# EAGLE design untitled (EAGLE 5.10)
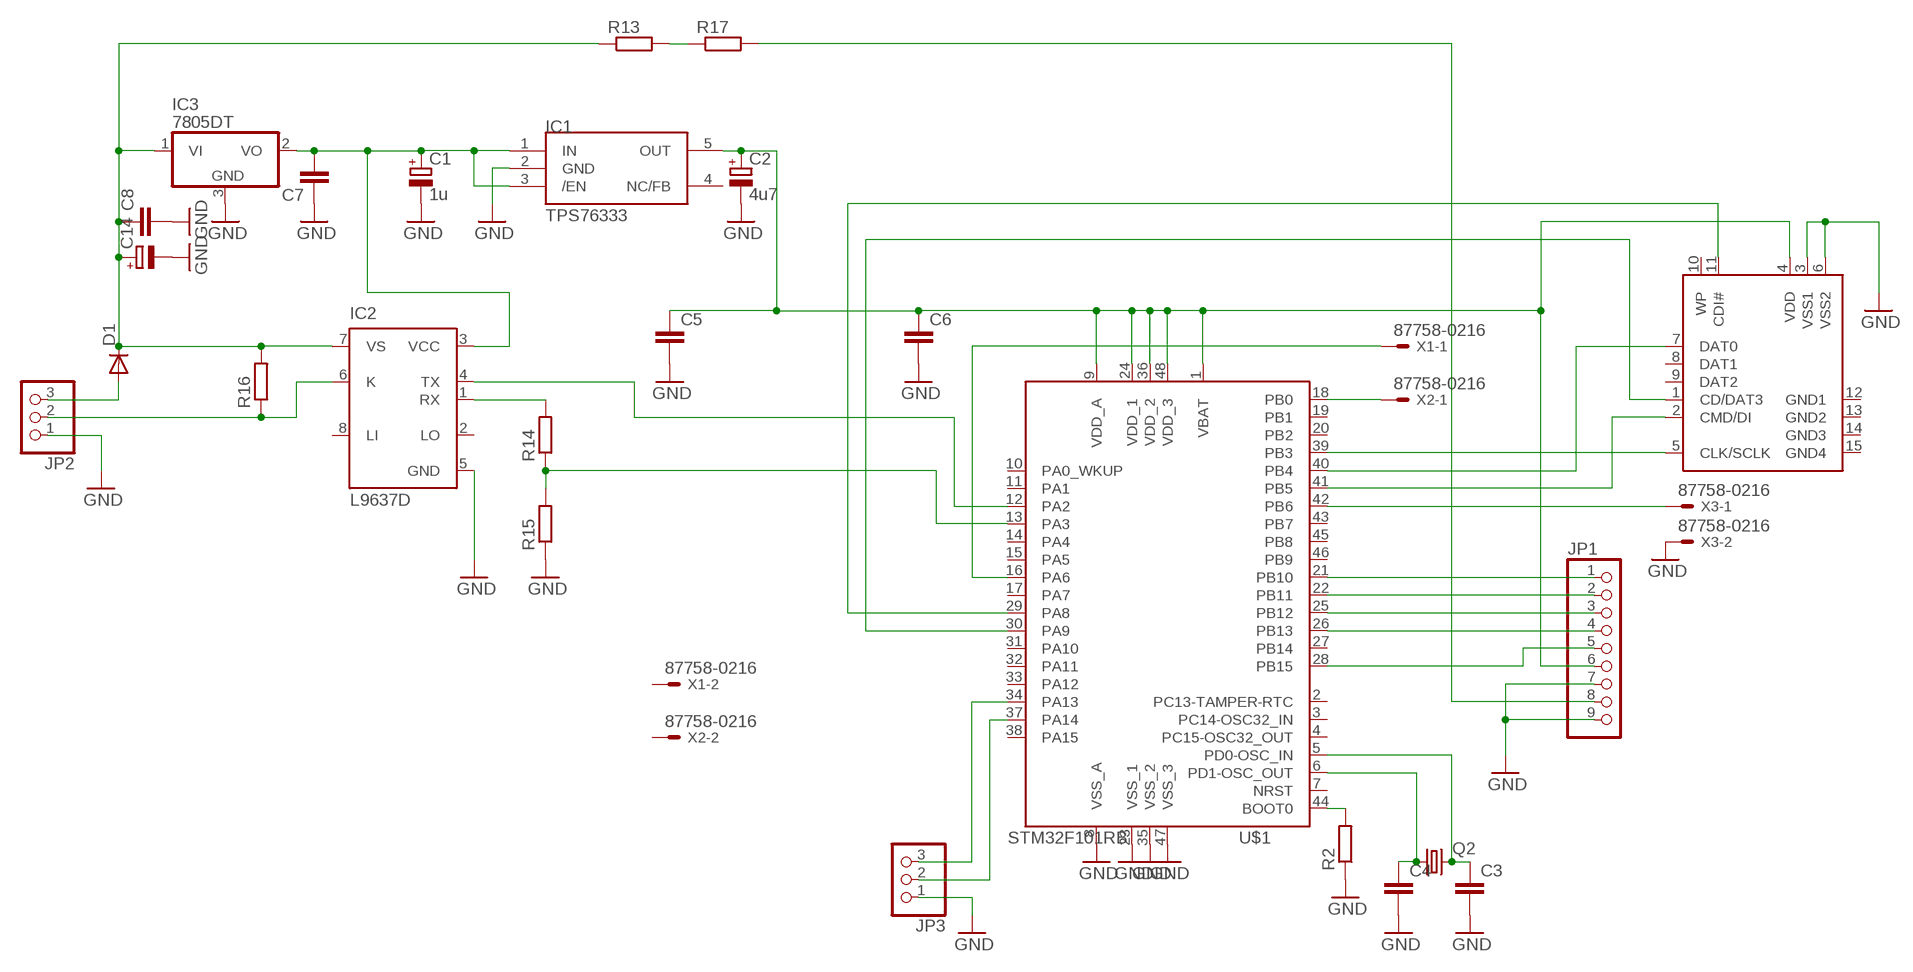
[diagram p0: schematic, sheet 1]

## Parts
C1  1u  CPOL-EUSMCA  [SMC_A]
C2  4u7  CPOL-EUSMCA  [SMC_A]
C3  C-EUC0603  [C0603]
C4  C-EUC0603  [C0603]
C5  C-EUC0603  [C0603]
C6  C-EUC0603  [C0603]
C7  C-EUC0805  [C0805]
C8  C-EUC1206  [C1206]
C14  CPOL-EU153CLV-0605  [153CLV-0605]
D1  DIODE-MINIMELF  [MINIMELF]
IC1  TPS76333  TPS769XX  [SOT23-5L]
IC2  L9637D  [SO08]
IC3  7805DT  [TO252]
JP1  PINHD-1X9  [1X09]
JP2  PINHD-1X3  [1X03]
JP3  PINHD-1X3  [1X03]
Q2  CRYSTALHC49S  [HC49/S]
R2  R-EU_R0603  [R0603]
R13  R-EU_R1206  [R1206]
R14  R-EU_R0603  [R0603]
R15  R-EU_R0603  [R0603]
R16  R-EU_R1206  [R1206]
R17  R-EU_R1206  [R1206]
U$1  STM32F101RB  [LQFP48]
U$2  SDCARDVAR1  [SDCMF-10915W010]
X1  87758-0216  [87758-0216]
X2  87758-0216  [87758-0216]
X3  87758-0216  [87758-0216]

## Nets
GND: C1.- C2.- C3.2 C4.2 C5.2 C6.2 C7.1 C8.2 C14.- IC1.2(GND) IC2.5(GND) IC3.3(GND) JP1.7 JP1.9 JP2.1 JP3.1 R2.1 R15.1 U$1.8(VSS_A) U$1.23(VSS_1) U$1.35(VSS_2) U$1.47(VSS_3) U$2.3(VSS1) U$2.6(VSS2) X3.2
N$1: JP1.5 U$1.28(PB15)
N$2: JP1.1 U$1.21(PB10)
N$3: C3.1 Q2.2 U$1.5(PD0-OSC_IN)
N$4: C4.1 Q2.1 U$1.6(PD1-OSC_OUT)
N$5: R2.2 U$1.44(BOOT0)
N$6: U$1.30(PA9) U$2.1(CD/DAT3)
N$7: JP1.4 U$1.26(PB13)
N$8: JP1.3 U$1.25(PB12)
N$9: JP1.2 U$1.22(PB11)
N$10: IC2.4(TX) U$1.12(PA2)
N$11: U$1.42(PB6) X3.1
N$12: C1.+ C7.2 IC1.1(IN) IC1.3(/EN) IC2.3(VCC) IC3.2(VO)
N$13: R14.1 R15.2 U$1.13(PA3)
N$14: IC2.1(RX) R14.2
N$15: C8.1 C14.+ D1.C IC2.7(VS) IC3.1(VI) R13.1 R16.2
N$16: IC2.6(K) JP2.2 R16.1
N$19: U$1.29(PA8) U$2.11(CDI#)
N$20: JP1.8 R17.2
N$21: U$1.39(PB3) U$2.5(CLK/SCLK)
N$22: D1.A JP2.3
N$23: JP3.2 U$1.37(PA14)
N$24: U$1.41(PB5) U$2.2(CMD/DI)
N$25: U$1.40(PB4) U$2.7(DAT0)
N$26: JP3.3 U$1.34(PA13)
N$33: U$1.16(PA6) X1.1
N$35: C2.+ C5.1 C6.1 IC1.5(OUT) JP1.6 U$1.1(VBAT) U$1.9(VDD_A) U$1.24(VDD_1) U$1.36(VDD_2) U$1.48(VDD_3) U$2.4(VDD)
N$36: U$1.18(PB0) X2.1
N$41: R13.2 R17.1
Unconnected: IC1.4(NC/FB) IC2.2(LO) IC2.8(LI) U$1.2(PC13-TAMPER-RTC) U$1.3(PC14-OSC32_IN) U$1.4(PC15-OSC32_OUT) U$1.7(NRST) U$1.10(PA0_WKUP) U$1.11(PA1) U$1.14(PA4) U$1.15(PA5) U$1.17(PA7) U$1.19(PB1) U$1.20(PB2) U$1.27(PB14) U$1.31(PA10) U$1.32(PA11) U$1.33(PA12) U$1.38(PA15) U$1.43(PB7) U$1.45(PB8) U$1.46(PB9) U$2.8(DAT1) U$2.9(DAT2) U$2.10(WP) X1.2 X2.2

## Power pins joined to a net without a drawn wire
GND1: U$2.12(GND1)
GND2: U$2.13(GND2)
GND3: U$2.14(GND3)
GND4: U$2.15(GND4)

## Library data of the parts
C1 C2 C14 = rcl:CPOL-EU: POLARIZED CAPACITOR, European symbol
C3-C8 = rcl:C-EU: CAPACITOR, European symbol
D1 = diode:DIODE-: DIODE
IC1 = tps769xx:TPS769XX
IC2 = st-microelectronics:L9637D: ISO 9141 INTERFACE Source: 1765.pdf
IC3 = linear:78*: Positive VOLTAGE REGULATOR Source: http://cache.national.com/ds/LM/LM78L05.pdf http://www.fairchildsemi.com/ds/LM/LM7805.pdf
JP1 = pinhead:PINHD-1X9: PIN HEADER
JP2 JP3 = pinhead:PINHD-1X3: PIN HEADER
Q2 = crystal:CRYSTAL: CRYSTAL
R2 R13-R17 = rcl:R-EU_: RESISTOR, European symbol
U$1 = stm32:STM32F101RB
U$2 = kingfont_sdcmf10915w010:SDCARD: SD card connector KINGFONT SDCMF-10915W010
X1-X3 = con-molex:87758-0216: 2 Pin - 2mm Dual Row Single Wafer, Vertical T/H HDR Source: http://www.molex.com/pdm_docs/sd/877580616_sd.pdf

## Board
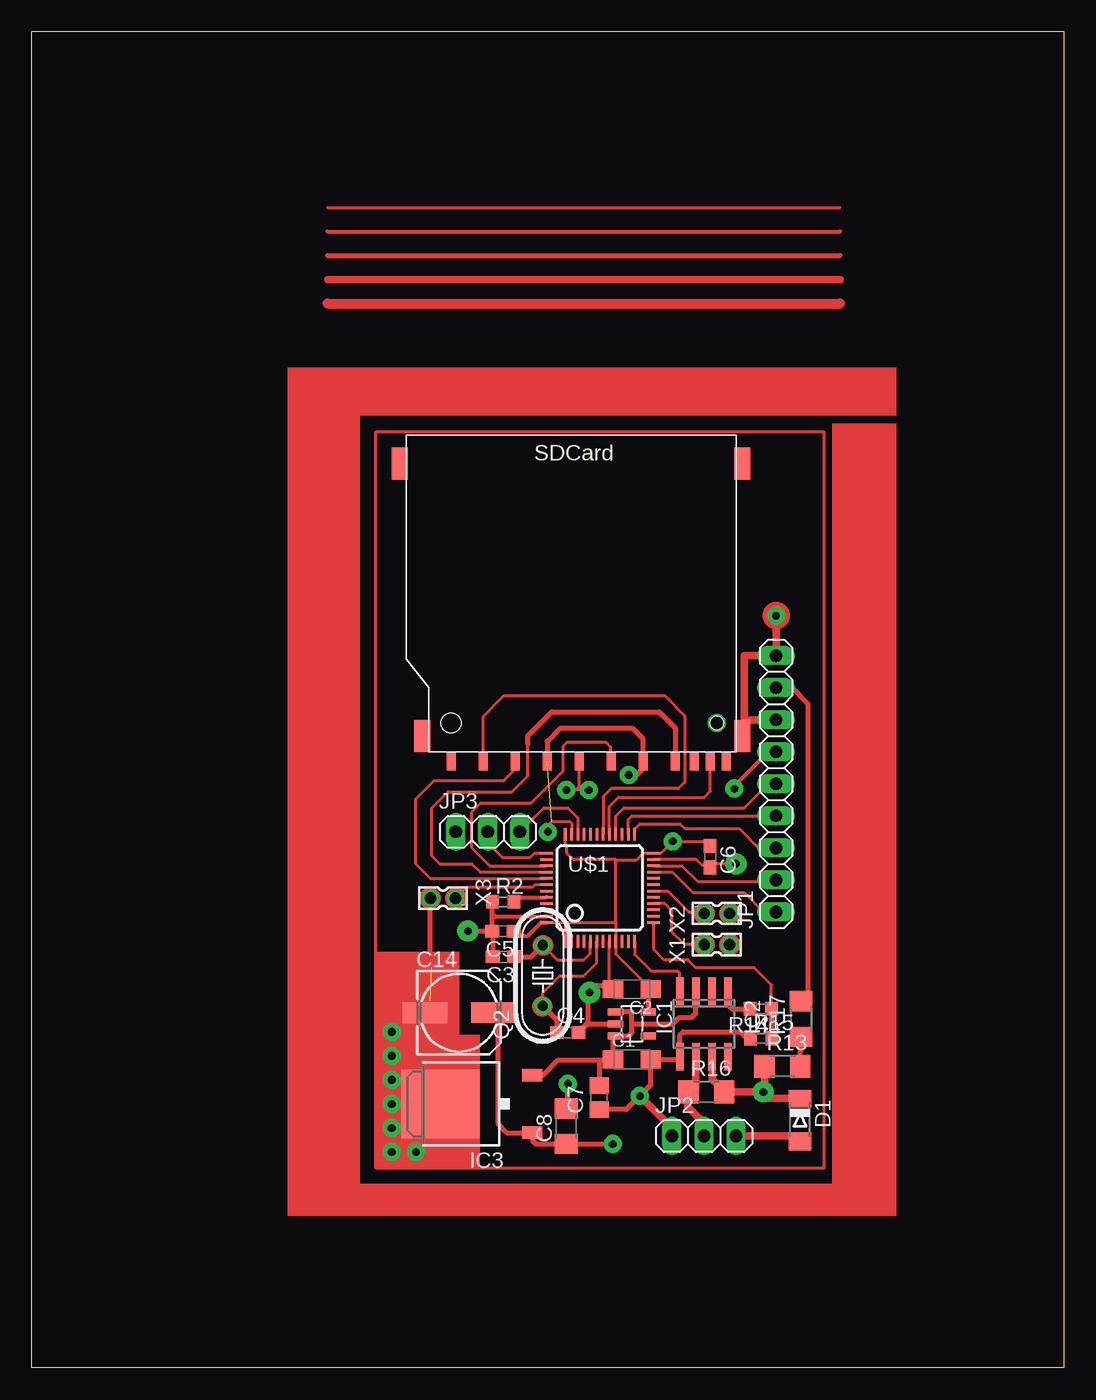
[diagram p1: board, top side]
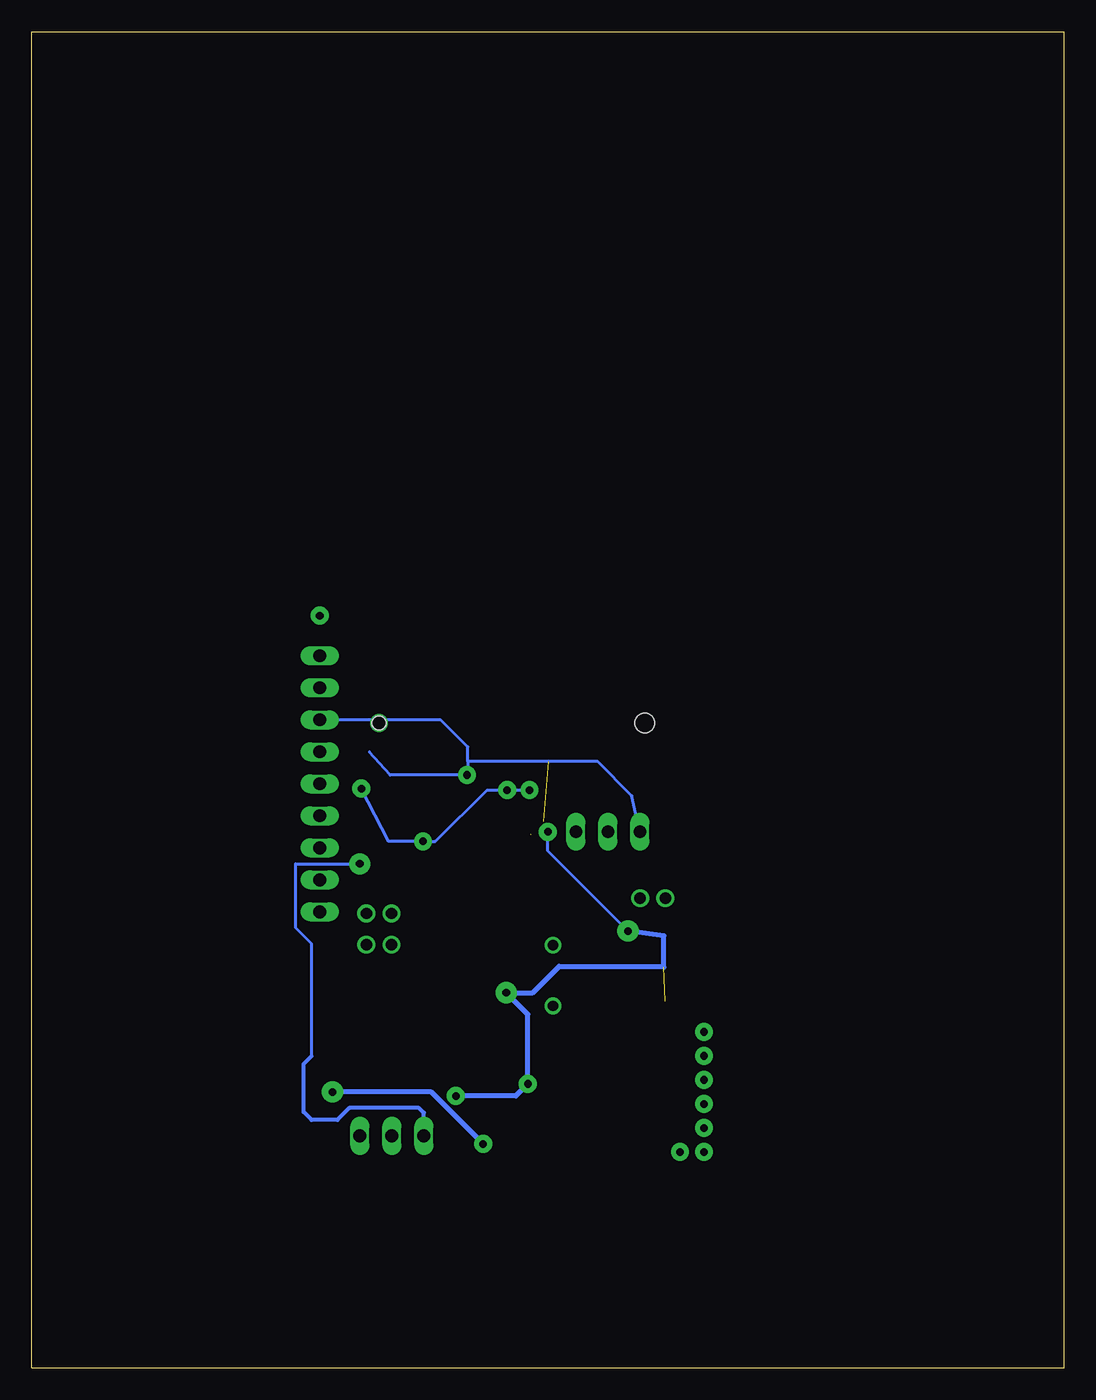
[diagram p2: board, bottom side, seen from below]

Size 81.91 x 106.05 mm. Coordinates in mm from the lower left corner, seen from the top.
Outline: 81.91,0 0,0 0,106.05 81.91,106.05 81.91,0
Copper layers (1*16): Top 0.035mm / dielectric 1.5mm / Bottom 0.035mm
Design rules "default": minimum track width 10mil, minimum drill 24mil, track to track 8mil, track to pad 8mil, pad to pad 8mil, via to via 8mil, smd to smd 8mil, copper to edge 40mil, drill to drill 8mil, minimum pad ring 10mil, minimum via ring 8mil, stop-mask expansion 4mil, vias tented up to drill 0mil, thermal gap 10mil

### Footprints (pad centres in the part's own frame; a part is rotated, then mirrored left to right if it is on the bottom)
SMC_A = smd 1.6 x 1.4: + -1.5,0; - 1.5,0
C0603 = smd 1.1 x 1: 1 -0.85,0; 2 0.85,0
C0805 = smd 1.3 x 1.5: 1 -0.95,0; 2 0.95,0
C1206 = smd 1.6 x 1.8: 1 -1.4,0; 2 1.4,0
153CLV-0605 = smd 3.5 x 1.6: + 2.7,0; - -2.7,0
MINIMELF = smd 1.4 x 1.8: A 1.7,0; C -1.7,0
SOT23-5L = smd 0.55 x 1.2: 1 -0.95,-1.3; 2 0,-1.3; 3 0.95,-1.3; 4 0.95,1.3; 5 -0.95,1.3
SO08 = smd 0.6 x 2.2: 1 -1.905,-2.6; 2 -0.635,-2.6; 3 0.635,-2.6; 4 1.905,-2.6; 5 1.905,2.6; 6 0.635,2.6; 7 -0.635,2.6; 8 -1.905,2.6
TO252 = smd 1 x 1.6: 1 -2.28,-4.8; 2 2.28,-4.8 | smd 5.4 x 6.2: 3 0,2.5
1X09 = drill 1.016 long: 1 -10.16,0; 2 -7.62,0; 3 -5.08,0; 4 -2.54,0; 5 0,0; 6 2.54,0; 7 5.08,0; 8 7.62,0; 9 10.16,0
1X03 = drill 1.016 long: 1 -2.54,0; 2 0,0; 3 2.54,0
HC49/S = drill 0.813 round: 1 -2.413,0; 2 2.413,0
R0603 = smd 1 x 1.1: 1 -0.85,0; 2 0.85,0
R1206 = smd 1.6 x 1.803: 1 -1.422,0; 2 1.422,0
LQFP48 = smd 0.2 x 1: 1 -2.75,-4.25; 2 -2.25,-4.25; 3 -1.75,-4.25; 4 -1.25,-4.25; 5 -0.75,-4.25; 6 -0.25,-4.25; 7 0.25,-4.25; 8 0.75,-4.25; 9 1.25,-4.25; 10 1.75,-4.25; 11 2.25,-4.25; 12 2.75,-4.25; 25 2.75,4.25; 26 2.25,4.25; 27 1.75,4.25; 28 1.25,4.25; 29 0.75,4.25; 30 0.25,4.25; 31 -0.25,4.25; 32 -0.75,4.25; 33 -1.25,4.25; 34 -1.75,4.25; 35 -2.25,4.25; 36 -2.75,4.25 | smd 1 x 0.2: 13 4.25,-2.75; 14 4.25,-2.25; 15 4.25,-1.75; 16 4.25,-1.25; 17 4.25,-0.75; 18 4.25,-0.25; 19 4.25,0.25; 20 4.25,0.75; 21 4.25,1.25; 22 4.25,1.75; 23 4.25,2.25; 24 4.25,2.75; 37 -4.25,2.75; 38 -4.25,2.25; 39 -4.25,1.75; 40 -4.25,1.25; 41 -4.25,0.75; 42 -4.25,0.25; 43 -4.25,-0.25; 44 -4.25,-0.75; 45 -4.25,-1.25; 46 -4.25,-1.75; 47 -4.25,-2.25; 48 -4.25,-2.75
SDCMF-10915W010 = smd 0.711 x 1.422: 1 7.366,13.462; 2 4.826,13.462; 3 2.286,13.462; 4 -0.254,13.462; 5 -2.794,13.462; 6 -5.334,13.462; 7 -7.874,13.462; 8 -9.398,13.462; 9 9.906,13.462; 10 -11.938,13.462; 11 -10.668,13.462 | smd 1.27 x 2.54: 12 12.192,11.43; 13 13.97,-10.16; 14 -13.208,-10.16; 15 -13.208,11.43 | hole 1.6: 9.906,10.414 | hole 1.1: -11.176,10.414
87758-0216 = drill 0.9 pad 1.27 round: 1 0,-1; 2 0,1

### Placement (x,y rotation side)
C1  47.62,24.49 0 top
C2  47.62,30.06 180 top
C3  37.44,32.63 180 top
C4  42.53,26.61 0 top
C5  37.4,34.67 180 top
C6  53.82,40.56 270 top
C7  45.02,21.46 90 top
C8  42.42,19.18 90 top
C14  33.91,28.19 0 top
D1  60.96,19.69 270 top
IC1  47.62,27.3 270 top
IC2  53.34,27.3 180 top
IC3  34.93,20.95 90 top
JP1  59.05,46.36 90 top
JP2  53.34,18.41 0 top
JP3  36.2,42.55 0 top
Q2  40.55,31.14 90 top
R2  37.41,37 0 top
R13  59.56,23.94 0 top
R14  57.85,28.51 180 top
R15  57.87,26.16 0 top
R16  53.53,21.91 0 top
R17  61.02,27.69 90 top
U$1  45.09,38.1 0 top
U$2  43.18,61.59 180 top
X1  54.36,33.59 270 top
X2  54.36,36.07 270 top
X3  32.64,37.27 90 top

### Tracks (layer width: path | path; a pad name or v marks a point on that pad's centre or on a via)
GND  (via drill 0.6 pad 1.42, 0.6 pad 1.68)  (2 unrouted)
  Top 0.254: U$1.8 45.84,30.35 C2.- | U$1.23 52.74,40.35 53.21,39.88 53.66,39.88 C6.2 54.11,40 v55.88,40 | U$1.35 42.84,43.21 42.67,43.37 41.27,43.37 40.96,43.05 v40.96,42.55
  Top 0.305: 36.77,35.85 U$1.47
  Top 0.406: v47.37,47.05 48.01,47.05 48.51,47.56 U$2.6 48.51,49.91 47.69,50.74 41.91,50.74 40.89,49.72 U$2.3 | C5.2 36.55,35.94 | 36.55,35.94 36.55,36.98 R2.1 | 36.77,35.85 36.64,35.85 36.55,35.94 | 45.84,30.35 44.83,30.35 v44.26,29.78 44.13,29.66 44.13,27.37 43.7,26.94 43.38,26.94 C4.2 44.08,27.3 IC1.2 | C8.2 42.42,20.83 42.55,20.95 v42.55,22.54 | IC3.3 31.21,22.17 C14.- 31.59,28.57 | C3.2 36.59,34.63 C5.2 | v34.61,34.67 C5.2 | R15.1 56.71,26.16 56.2,26.67 51.69,26.67 51.44,26.42 51.44,25.4 51.37,25.34 51.37,24.77 IC2.5 51.44,24.32 51.27,24.49 C1.- 49.12,22.45 v48.26,21.59 47.18,20.51 C7.1 | X3.2 31.64,29.1 31.12,28.57 31.59,28.57 | 31.59,28.57 31.75,28.57
  Top 0.61: JP1.7 56.52,51.44 56.52,56.52 JP1.9 59.05,59.69 | JP2.1 50.8,19.05 v48.26,21.59
  Bottom 0.254: 55.12,48.9 53.47,47.05 v47.37,47.05 47.31,47.12 47.31,48.13 | JP1.7 49.47,51.44 47.31,49.28 47.31,48.13 | 47.31,48.13 37.02,48.13 34.29,45.4 JP3.1 | 59.69,24.77 59.69,33.66 60.96,34.92 60.96,40 v55.88,40 | v40.96,42.55 40.96,41.02 v34.61,34.67
  Bottom 0.305: 59.69,24.77 60.32,24.13 60.32,20.32 59.69,19.69 57.66,19.69 56.71,20.64 51.18,20.64 50.8,20.26 JP2.1
  Bottom 0.406: v34.61,34.67 31.75,34.29 31.75,31.81 31.81,31.88 40.07,31.88 42.16,29.78 v44.26,29.78 42.55,28.07 v42.55,22.54 43.5,21.59 v48.26,21.59
N$1
  Top 0.254: U$1.28 46.34,43.8 46.99,44.45 56.52,44.45 58.42,46.36 JP1.5
N$2
  Top 0.254: U$1.21 50.82,39.35 52.45,37.72 56.52,37.72 58.04,36.2 JP1.1
N$3
  Top 0.254: U$1.5 44.34,32.91 43.82,32.39 41.72,32.39 Q2.2
  Top 0.406: C3.1 39.62,32.63 Q2.2
N$4
  Top 0.254: Q2.1 40.55,29.76 41.91,31.12 43.82,31.12 44.83,32.13 U$1.6
  Top 0.406: C4.1 41.68,27.6 Q2.1
N$5
  Top 0.305: U$1.44 38.62,37.35 R2.2
N$6
  Top 0.254: U$1.30 45.34,45.34 45.97,45.97 51.31,45.97 51.82,46.48 51.82,51.75 50.23,53.34 37.47,53.34 35.81,51.69 U$2.1
N$7
  Top 0.254: U$1.26 47.34,43.52 47.62,43.81 JP1.4
N$8
  Top 0.254: U$1.25 47.84,42.76 48.26,43.18 51.44,43.18 51.82,42.8 56.13,42.8 57.66,41.27 JP1.3
N$9
  Top 0.254: U$1.22 51.59,39.85 52.83,38.61 58.93,38.61 JP1.2
N$10
  Top 0.254: U$1.12 47.84,32.81 49.15,31.5 51.25,31.5 51.37,31.37 51.37,30.6 IC2.4
N$11
  Top 0.254: U$1.42 39.94,38.35 39.75,38.16 34.53,38.16 X3.1
N$12
  Top 0.406: C1.+ 46.12,26.16 IC1.3 47.37,26.35 47.62,26.61 47.62,27.3 | IC1.1 47.62,28.25 47.62,28.26 47.62,27.3 | C1.+ 46.16,24.45 | IC3.2 40.57,23.23 41.78,24.45 45.09,24.45 | 45.09,24.45 46.09,24.45 C1.+ | 47.62,27.3 50.86,27.3 51.37,27.81 52.39,27.81 52.7,28.13 IC2.3 | C7.2 45.02,24.38 45.09,24.45
N$13
  Top 0.254: U$1.13 49.34,33.22 50.16,32.39 52.07,32.39 52.7,31.75 57.34,31.75 58.67,30.42 58.67,28.54 R14.1 58.36,28.85
  Top 0.406: R15.2 58.72,28.49 R14.1
N$14
  Top 0.406: R14.2 55.56,28.51 55.24,28.83 IC2.1
N$15  (via drill 0.6 pad 1.42, 0.6 pad 1.68)
  Top 0.406: 53.98,24.07 IC2.7 | v46.1,17.78 C8.1 40.01,17.78 39.73,18.06 IC3.1 37.71,18.68 37.02,19.37 37.02,27.78 C14.+
  Top 0.61: v58.04,21.91 R16.2 53.98,22.88 53.98,24.07 | D1.C 58.56,21.38 v58.04,21.91 | R13.1 58.14,22.01 v58.04,21.91
  Bottom 0.406: v58.04,21.91 50.23,21.91 v46.1,17.78
N$16
  Top 0.406: 52.7,21.97 R16.1 52.7,21.85
  Top 0.61: JP2.2 53.34,19.43 52.07,20.7 52.07,21.87 R16.1 | IC2.6 52.7,21.97
N$17  (via drill 0.6 pad 1.42)
  other vias: 28.58,17.15
N$18
  Top 0.254: 27.3,74.3 62.87,74.3 62.87,15.88 27.3,15.88 27.3,74.3
N$19
  Top 0.254: 53.98,48.01 U$2.11 53.85,45.78 53.34,45.28 46.55,45.28 45.84,44.56 U$1.29
N$20
  Top 0.406: JP1.8 60.32,53.98 61.6,52.7 61.6,29.68 R17.2
N$21
  Top 0.254: U$1.39 36.35,39.85 34.93,41.27 34.93,44.13 35.62,44.83 39.62,44.83 42.16,47.37 42.16,49.34 42.48,49.66 45.53,49.66 45.91,49.28 45.91,48.2 U$2.5
N$22
  Top 0.61: JP2.3 60.53,18.41 D1.A
N$23
  Top 0.254: U$1.37 39.9,40.85 39.56,40.51 37.34,40.51 36.2,41.66 JP3.2
N$24
  Top 0.254: 38.35,47.88 U$2.2 38.29,48.07 38.29,47.43 37.47,46.61 31.94,46.61 30.48,45.15 30.48,40 31.62,38.86 40.82,38.86 U$1.41
N$25
  Top 0.254: U$1.40 35.58,39.35 34.93,40 32.38,40 31.75,40.64 31.75,44.45 33.02,45.72 38.1,45.72 39.37,46.99 39.37,49.53
  Top 0.406: 39.37,49.53 39.37,50.16 41.27,52.07 49.78,52.07 51.05,50.8 U$2.7
N$26
  Top 0.254: U$1.34 43.34,43.66 42.55,44.45 40.64,44.45 JP3.3
N$27  (via drill 0.6 pad 1.42)
  other vias: 28.58,19.05
N$28  (via drill 0.6 pad 1.42)
  other vias: 28.58,20.95
N$29  (via drill 0.6 pad 1.42)
  other vias: 28.58,22.86
N$30  (via drill 0.6 pad 1.42)
  other vias: 28.58,24.77
N$31  (via drill 0.6 pad 1.42)
  other vias: 28.58,26.67
N$32  (via drill 0.6 pad 1.42)
  other vias: 30.48,17.15
N$33
  Top 0.254: U$1.16 50.21,36.85 50.8,36.26 50.8,34.61 51.82,33.59 X1.1
N$34  (via drill 0.6 pad 1.42)
  other vias: 59.05,59.69
N$35  (via drill 0.6 pad 1.42)  (1 unrouted)
  Top 0.254: 42.34,42.37 42.34,41.53 42.47,41.4 42.47,40.84 42.98,40.34 46.33,40.34 46.36,40.31 | 46.36,35.36 46.36,34.29 46.34,34.27 U$1.9 46.34,32.85 46.93,32.26 C2.+ 49.09,30.1 | 46.36,35.36 46.36,40.31 | 46.36,35.36 46.33,35.36 46.32,35.35 42.32,35.35 | U$1.48 42.32,35.35 | 42.32,35.35 42.32,35.33 42.34,35.31 U$1.1 | 46.36,40.31 46.37,40.32 48.01,40.32 48.53,40.85 U$1.24 49.93,40.85 v50.86,41.78 53.45,41.78 C6.1 | v44.2,45.85 43.18,45.85 | 43.18,45.85 v42.42,45.85 | U$2.4 43.43,46.1 43.18,45.85
  Top 0.305: U$1.48 40.43,35.35 39.37,34.29 38.32,34.29 C5.1 | JP1.6 58.42,48.9 55.88,46.36 55.88,46.1 v55.75,45.97
  Top 0.406: IC1.5 48.93,29.86 C2.+
  Bottom 0.254: v55.75,45.97 53.59,41.78 v50.86,41.78 49.91,41.78 45.78,45.85 v44.2,45.85 v42.42,45.85
N$36
  Top 0.254: U$1.18 50.48,37.85 52.13,36.2 53.23,36.2 X2.1
N$37  (via drill 0.6 pad 1.42)
  other vias: 33.27,51.18
N$38  (via drill 0.6 pad 1.42)
  other vias: 54.36,51.18
N$39
  Top 0.254: 23.5,92.08 64.13,92.08
N$40
  Top 0.305: 23.5,90.17 64.13,90.17
N$41
  Top 0.406: R13.2 R17.1
N$42
  Top 0.406: 23.5,88.27 64.13,88.27
N$43
  Top 0.61: 23.5,86.36 64.13,86.36
N$44
  Top 0.813: 23.5,84.45 64.13,84.45
(copper drawn outside any net)
  shapes: Top area x6, Top circle x9